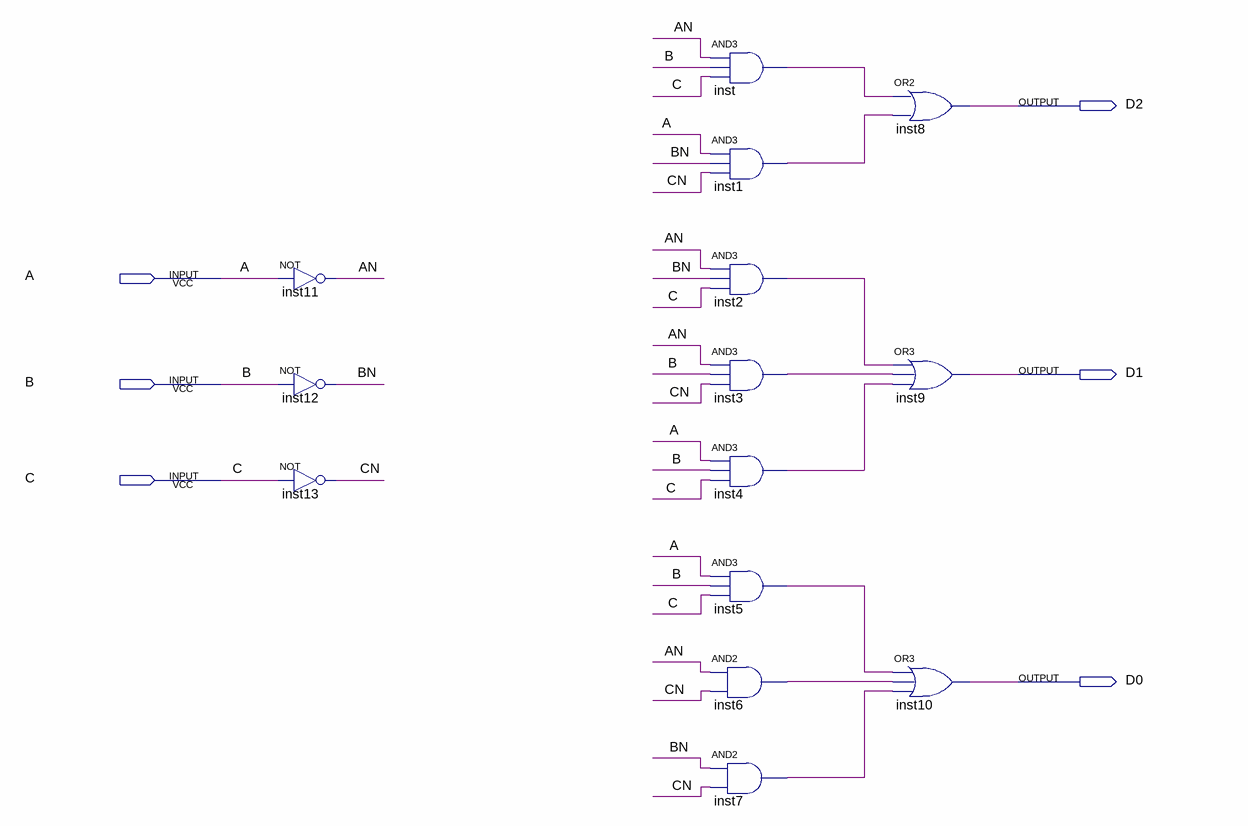
[diagram p0: schematic sheet]
// Quartus schematic NEXT_STATE.bdf as structural Verilog: 14 symbols, 6 pins
module NEXT_STATE (
  input  A,
  input  B,
  input  C,
  output D2,
  output D1,
  output D0
);

  wire AN, BN, CN, inst1_out, inst2_out, inst3_out, inst4_out, inst5_out, inst6_out, inst7_out, inst_out;

  not inst11 (AN, A);
  not inst12 (BN, B);
  not inst13 (CN, C);
  and inst (inst_out, AN, B, C);
  and inst1 (inst1_out, A, BN, CN);
  and inst2 (inst2_out, AN, BN, C);
  and inst3 (inst3_out, AN, B, CN);
  and inst4 (inst4_out, A, B, C);
  and inst5 (inst5_out, A, B, C);
  and inst6 (inst6_out, AN, CN);
  and inst7 (inst7_out, BN, CN);
  or inst8 (D2, inst_out, inst1_out);
  or inst9 (D1, inst2_out, inst3_out, inst4_out);
  or inst10 (D0, inst5_out, inst6_out, inst7_out);
endmodule
